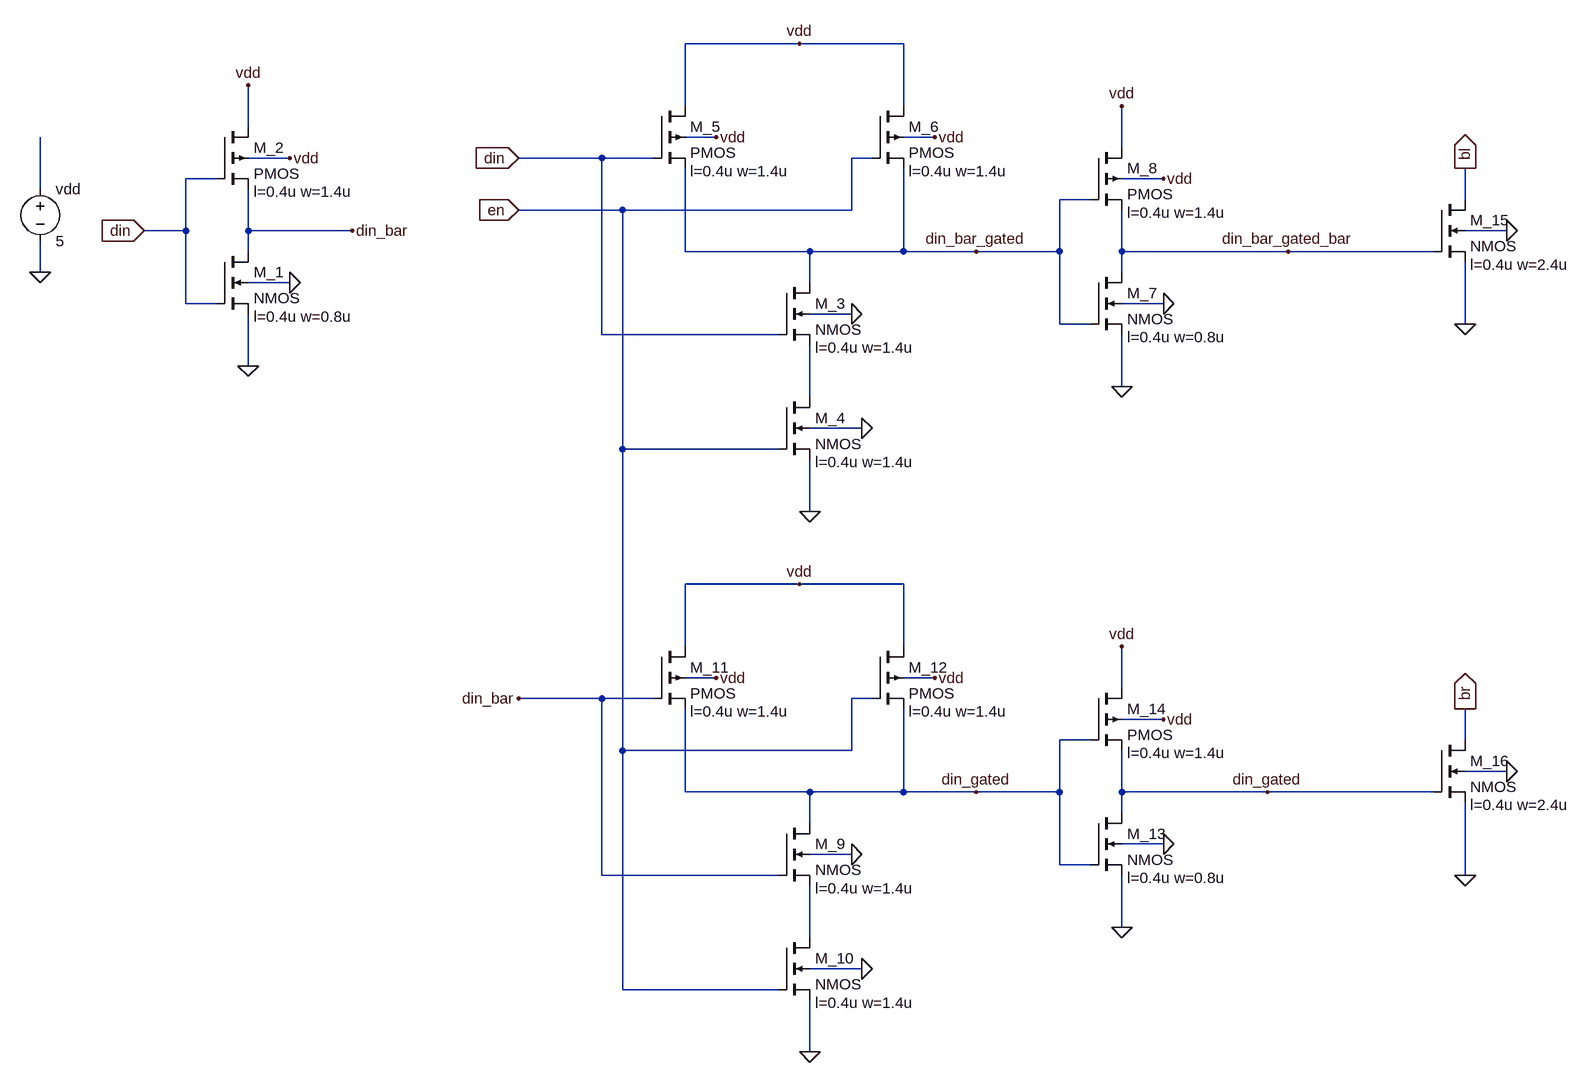
[diagram p0: schematic write_driver.asc]
write_driver.asc, the LTspice schematic file:
Version 4
SHEET 1 2472 1444
WIRE 928 -128 752 -128
WIRE 1088 -128 928 -128
WIRE 752 -32 752 -128
WIRE 1088 -32 1088 -128
WIRE 80 0 80 -64
WIRE 800 16 752 16
WIRE 1136 16 1088 16
WIRE 1424 32 1424 -32
WIRE 144 48 80 48
WIRE 624 48 496 48
WIRE 704 48 624 48
WIRE 1040 48 1008 48
WIRE 32 80 -16 80
WIRE 1488 80 1424 80
WIRE -240 96 -240 16
WIRE 1376 112 1328 112
WIRE 1952 112 1952 64
WIRE 656 128 496 128
WIRE 1008 128 1008 48
WIRE 1008 128 656 128
WIRE -16 160 -16 80
WIRE -16 160 -80 160
WIRE 80 160 80 96
WIRE 240 160 80 160
WIRE 2016 160 1952 160
WIRE 80 192 80 160
WIRE 752 192 752 64
WIRE 944 192 752 192
WIRE 1088 192 1088 64
WIRE 1088 192 944 192
WIRE 1200 192 1088 192
WIRE 1328 192 1328 112
WIRE 1328 192 1200 192
WIRE 1424 192 1424 128
WIRE 1680 192 1424 192
WIRE 1904 192 1680 192
WIRE -240 224 -240 176
WIRE 1424 224 1424 192
WIRE 144 240 80 240
WIRE 944 240 944 192
WIRE -16 272 -16 160
WIRE 32 272 -16 272
WIRE 1488 272 1424 272
WIRE 1008 288 944 288
WIRE 1328 304 1328 192
WIRE 1376 304 1328 304
WIRE 1952 304 1952 208
WIRE 624 320 624 48
WIRE 896 320 624 320
WIRE 80 368 80 288
WIRE 1424 400 1424 320
WIRE 944 416 944 336
WIRE 1024 464 944 464
WIRE 656 496 656 128
WIRE 896 496 656 496
WIRE 944 592 944 512
WIRE 928 704 752 704
WIRE 1088 704 928 704
WIRE 752 800 752 704
WIRE 1088 800 1088 704
WIRE 800 848 752 848
WIRE 1136 848 1088 848
WIRE 1424 864 1424 800
WIRE 624 880 496 880
WIRE 704 880 624 880
WIRE 1040 880 1008 880
WIRE 1488 912 1424 912
WIRE 1376 944 1328 944
WIRE 1952 944 1952 896
WIRE 656 960 656 496
WIRE 1008 960 1008 880
WIRE 1008 960 656 960
WIRE 2016 992 1952 992
WIRE 752 1024 752 896
WIRE 944 1024 752 1024
WIRE 1088 1024 1088 896
WIRE 1088 1024 944 1024
WIRE 1200 1024 1088 1024
WIRE 1328 1024 1328 944
WIRE 1328 1024 1200 1024
WIRE 1424 1024 1424 960
WIRE 1648 1024 1424 1024
WIRE 1904 1024 1648 1024
WIRE 1424 1056 1424 1024
WIRE 944 1072 944 1024
WIRE 1488 1104 1424 1104
WIRE 1008 1120 944 1120
WIRE 1328 1136 1328 1024
WIRE 1376 1136 1328 1136
WIRE 624 1152 624 880
WIRE 896 1152 624 1152
WIRE 1952 1152 1952 1040
WIRE 1424 1232 1424 1152
WIRE 944 1248 944 1168
WIRE 1024 1296 944 1296
WIRE 656 1328 656 960
WIRE 896 1328 656 1328
WIRE 944 1424 944 1344
FLAG -240 224 0
FLAG 80 368 0
FLAG 80 -64 vdd
FLAG -80 160 din
IOPIN -80 160 In
FLAG 240 160 din_bar
FLAG 944 592 0
FLAG 1024 464 0
FLAG 1008 288 0
FLAG 144 240 0
FLAG 144 48 vdd
FLAG 800 16 vdd
FLAG 1136 16 vdd
FLAG 1200 192 din_bar_gated
FLAG 496 48 din
IOPIN 496 48 In
FLAG 496 128 en
IOPIN 496 128 In
FLAG 928 -128 vdd
FLAG 1424 400 0
FLAG 1424 -32 vdd
FLAG 1488 272 0
FLAG 1488 80 vdd
FLAG 1680 192 din_bar_gated_bar
FLAG 944 1424 0
FLAG 1024 1296 0
FLAG 1008 1120 0
FLAG 800 848 vdd
FLAG 1136 848 vdd
FLAG 928 704 vdd
FLAG 1424 1232 0
FLAG 1424 800 vdd
FLAG 1488 1104 0
FLAG 1488 912 vdd
FLAG 496 880 din_bar
FLAG 1200 1024 din_gated
FLAG 1648 1024 din_gated
FLAG 1952 304 0
FLAG 2016 160 0
FLAG 2016 992 0
FLAG 1952 1152 0
FLAG 1952 64 bl
IOPIN 1952 64 Out
FLAG 1952 896 br
IOPIN 1952 896 Out
SYMBOL nmos4 32 192 R0
WINDOW 123 56 100 Left 2
SYMATTR Value2 l=0.4u w=0.8u
SYMATTR InstName M_1
SYMBOL pmos4 32 0 R0
WINDOW 123 56 100 Left 2
SYMATTR Value2 l=0.4u w=1.4u
SYMATTR InstName M_2
SYMBOL voltage -240 80 R0
WINDOW 123 0 0 Left 0
WINDOW 39 0 0 Left 0
SYMATTR InstName vdd
SYMATTR Value 5
SYMBOL nmos4 896 240 R0
WINDOW 123 56 100 Left 2
SYMATTR Value2 l=0.4u w=1.4u
SYMATTR InstName M_3
SYMBOL nmos4 896 416 R0
WINDOW 123 56 100 Left 2
SYMATTR Value2 l=0.4u w=1.4u
SYMATTR InstName M_4
SYMBOL pmos4 704 -32 R0
WINDOW 123 56 100 Left 2
SYMATTR Value2 l=0.4u w=1.4u
SYMATTR InstName M_5
SYMBOL pmos4 1040 -32 R0
WINDOW 123 56 100 Left 2
SYMATTR Value2 l=0.4u w=1.4u
SYMATTR InstName M_6
SYMBOL nmos4 1376 224 R0
WINDOW 123 56 100 Left 2
SYMATTR Value2 l=0.4u w=0.8u
SYMATTR InstName M_7
SYMBOL pmos4 1376 32 R0
WINDOW 123 56 100 Left 2
SYMATTR Value2 l=0.4u w=1.4u
SYMATTR InstName M_8
SYMBOL nmos4 896 1072 R0
WINDOW 123 56 100 Left 2
SYMATTR Value2 l=0.4u w=1.4u
SYMATTR InstName M_9
SYMBOL nmos4 896 1248 R0
WINDOW 123 56 100 Left 2
SYMATTR Value2 l=0.4u w=1.4u
SYMATTR InstName M_10
SYMBOL pmos4 704 800 R0
WINDOW 123 56 100 Left 2
SYMATTR Value2 l=0.4u w=1.4u
SYMATTR InstName M_11
SYMBOL pmos4 1040 800 R0
WINDOW 123 56 100 Left 2
SYMATTR Value2 l=0.4u w=1.4u
SYMATTR InstName M_12
SYMBOL nmos4 1376 1056 R0
WINDOW 123 56 100 Left 2
SYMATTR Value2 l=0.4u w=0.8u
SYMATTR InstName M_13
SYMBOL pmos4 1376 864 R0
WINDOW 123 56 100 Left 2
SYMATTR Value2 l=0.4u w=1.4u
SYMATTR InstName M_14
SYMBOL nmos4 1904 112 R0
WINDOW 123 56 100 Left 2
SYMATTR Value2 l=0.4u w=2.4u
SYMATTR InstName M_15
SYMBOL nmos4 1904 944 R0
WINDOW 123 56 100 Left 2
SYMATTR Value2 l=0.4u w=2.4u
SYMATTR InstName M_16

The netlist it stands for:
* write_driver.asc
M_1 din_bar din 0 0 NMOS l=0.4u w=0.8u
M_2 vdd din din_bar vdd PMOS l=0.4u w=1.4u
vdd N001 0 5
M_3 din_bar_gated din N002 0 NMOS l=0.4u w=1.4u
M_4 N002 en 0 0 NMOS l=0.4u w=1.4u
M_5 vdd din din_bar_gated vdd PMOS l=0.4u w=1.4u
M_6 vdd en din_bar_gated vdd PMOS l=0.4u w=1.4u
M_7 din_bar_gated_bar din_bar_gated 0 0 NMOS l=0.4u w=0.8u
M_8 vdd din_bar_gated din_bar_gated_bar vdd PMOS l=0.4u w=1.4u
M_9 din_gated din_bar N003 0 NMOS l=0.4u w=1.4u
M_10 N003 en 0 0 NMOS l=0.4u w=1.4u
M_11 vdd din_bar din_gated vdd PMOS l=0.4u w=1.4u
M_12 vdd en din_gated vdd PMOS l=0.4u w=1.4u
M_13 din_gated din_gated 0 0 NMOS l=0.4u w=0.8u
M_14 vdd din_gated din_gated vdd PMOS l=0.4u w=1.4u
M_15 bl din_bar_gated_bar 0 0 NMOS l=0.4u w=2.4u
M_16 br din_gated 0 0 NMOS l=0.4u w=2.4u
.model NMOS NMOS
.model PMOS PMOS
.lib standard.mos
.backanno
.end